# Altium project Shuttler_AMC.PrjPcb (part 5 of 20)

## Sheet DAC_supply.SchDoc: =ProjectName
size 420 x 297 mm; Author: T.P.; CompanyName: WUT; DrawnBy: T.P.; Organization: WUT ISE; Address1: Warsaw Univeristy of Technology; Address2: Nowowiejska 15/19; DocumentNumber: 26; Revision: 0.9; SheetNumber: 26; SheetTotal: 36; EDA_Number: ARTIQ; Projet: ARTIQ/SINARA; ModifiedBy: -; CreateDate: XX/XX/XXXX; CheckedDate: -; Title2: DAC_supply.SchDoc; DivGrp: ISE; Designer: G.K. and T.P.; ModifiedDate: -; ProjectName: ADC/DAC MEZZANINE
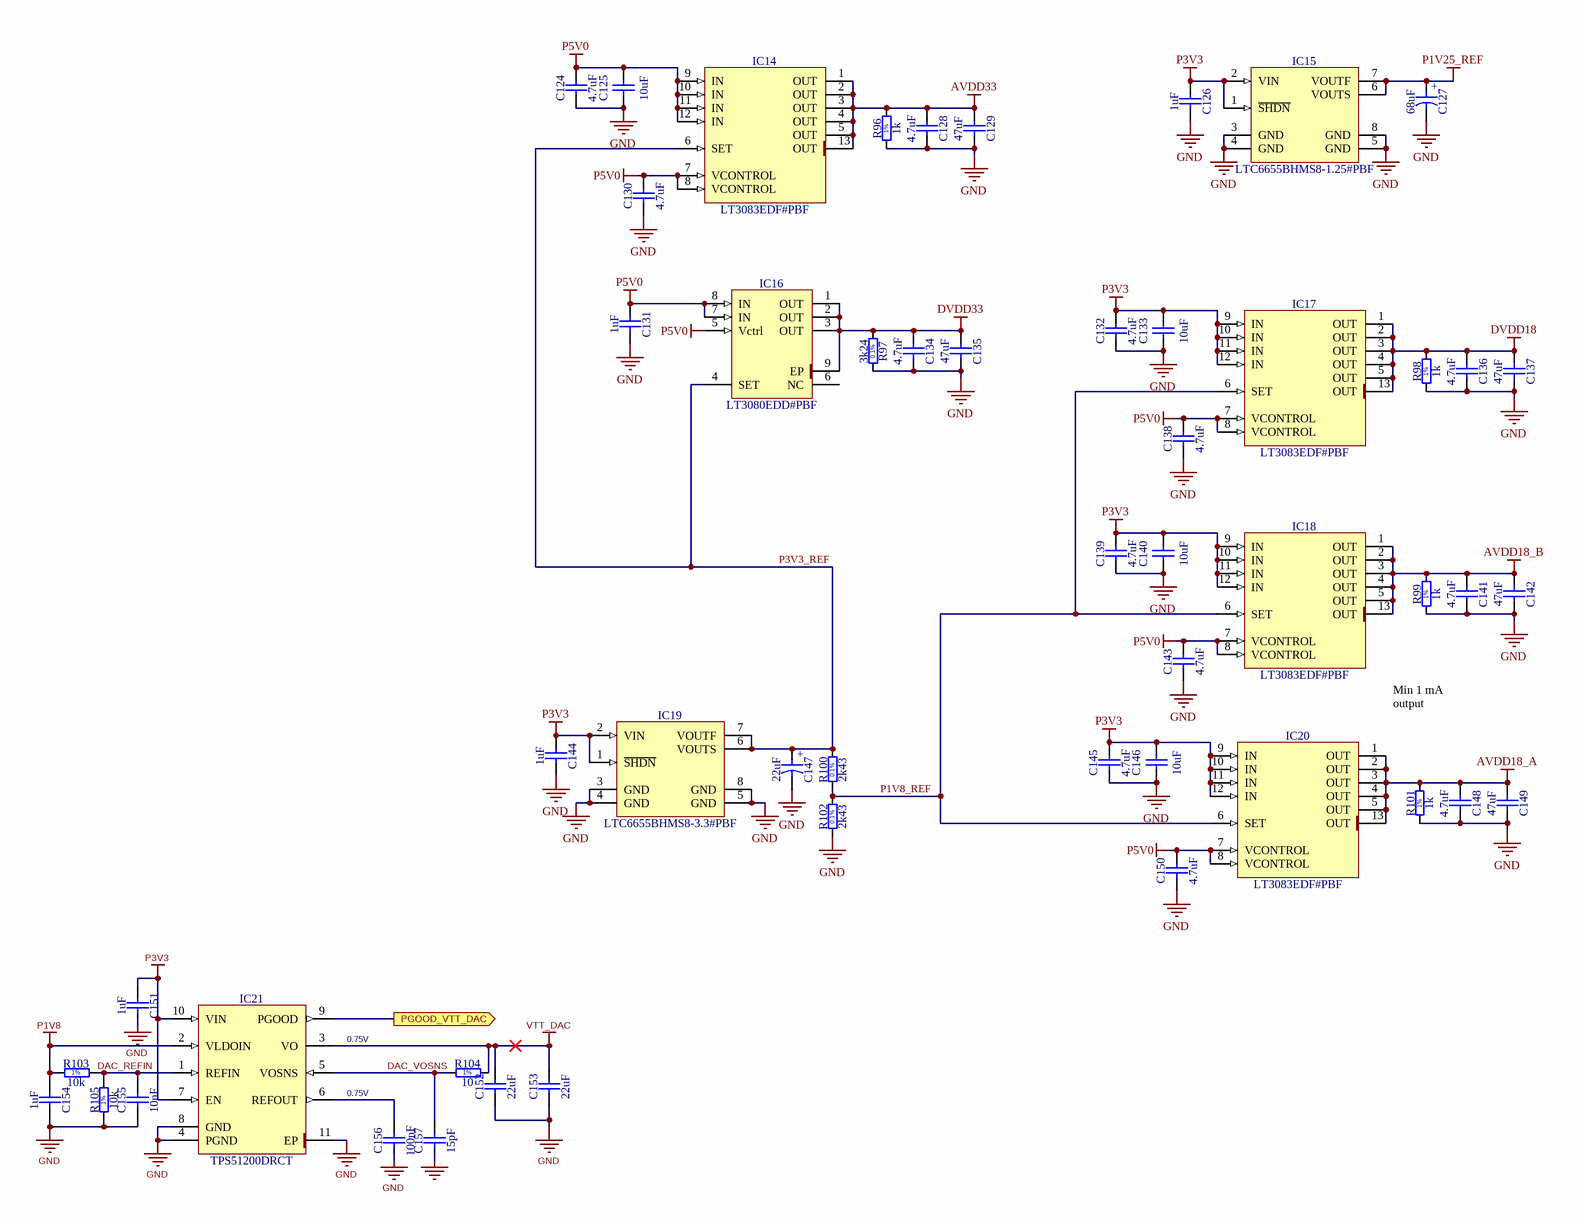
[diagram p8: DAC_supply.SchDoc]

### Parts
C124  4.7uF  [CAPC1005X55N]
C125  10uF  [CAPC3216X180N]
C126  1uF  [CAPC1005X55N]
C127  68uF  [CAPPR250-680X1080]
C128  4.7uF  [CAPC1005X55N]
C129  47uF  [CAPC3225X270N]
C130  4.7uF  [CAPC1005X55N]
C131  1uF  [CAPC1005X55N]
C132  4.7uF  [CAPC1005X55N]
C133  10uF  [CAPC3216X180N]
C134  4.7uF  [CAPC1005X55N]
C135  47uF  [CAPC3225X270N]
C136  4.7uF  [CAPC1005X55N]
C137  47uF  [CAPC3225X270N]
C138  4.7uF  [CAPC1005X55N]
C139  4.7uF  [CAPC1005X55N]
C140  10uF  [CAPC3216X180N]
C141  4.7uF  [CAPC1005X55N]
C142  47uF  [CAPC3225X270N]
C143  4.7uF  [CAPC1005X55N]
C144  1uF  [CAPC1005X55N]
C145  4.7uF  [CAPC1005X55N]
C146  10uF  [CAPC3216X180N]
C147  22uF  [CAPAE530X540N]
C148  4.7uF  [CAPC1005X55N]
C149  47uF  [CAPC3225X270N]
C150  4.7uF  [CAPC1005X55N]
C151  1uF  [CAPC1005X55N]
C152  22uF  [CAPC2012X135N]
C153  22uF  [CAPC2012X135N]
C154  1uF  [CAPC1005X55N]
C155  10nF  [CAPC1005X55N]
C156  100nF  [CAPC0603X33N]
C157  15pF  [CAPC1005X55N]
IC14  LT3083EDF#PBF  [SON50P400X400X80-13N-R275X350]
IC15  LTC6655BHMS8-1.25#PBF  [SOP65P490X110-8N]
IC16  LT3080EDD#PBF  [SON50P300X300X80-9N-R175X248]
IC17  LT3083EDF#PBF  [SON50P400X400X80-13N-R275X350]
IC18  LT3083EDF#PBF  [SON50P400X400X80-13N-R275X350]
IC19  LTC6655BHMS8-3.3#PBF  [SOP65P490X110-8N]
IC20  LT3083EDF#PBF  [SON50P400X400X80-13N-R275X350]
IC21  TPS51200DRCT  [TEXAS_DRC (S-PVSON-N10)]
R96  1k  [RESC1005X40N]
R97  3k24  [RESC1608X55N]
R98  1k  [RESC1005X40N]
R99  1k  [RESC1005X40N]
R100  2k43  [RESC1608X55N]
R101  1k  [RESC1005X40N]
R102  2k43  [RESC1608X55N]
R103  10k  [RESC1005X40N]
R104  10  [RESC1005X40N]
R105  10k  [RESC1005X40N]

### Ports
PGOOD_VTT_DAC (out)

### Nets
AVDD18_A: C148.2 C149.2 IC20.1(OUT) IC20.2(OUT) IC20.3(OUT) IC20.4(OUT) IC20.5(OUT) IC20.13(OUT) R101.2
AVDD18_B: C141.2 C142.2 IC18.1(OUT) IC18.2(OUT) IC18.3(OUT) IC18.4(OUT) IC18.5(OUT) IC18.13(OUT) R99.2
AVDD33: C128.2 C129.2 IC14.1(OUT) IC14.2(OUT) IC14.3(OUT) IC14.4(OUT) IC14.5(OUT) IC14.13(OUT) R96.2
DVDD18: C136.2 C137.2 IC17.1(OUT) IC17.2(OUT) IC17.3(OUT) IC17.4(OUT) IC17.5(OUT) IC17.13(OUT) R98.2
DVDD33: C134.2 C135.2 IC16.1(OUT) IC16.2(OUT) IC16.3(OUT) IC16.9(EP) R97.2
GND: C124.1 C125.1 C126.1 C127.2 C128.1 C129.1 C130.1 C131.1 C132.1 C133.1 C134.1 C135.1 C136.1 C137.1 C138.1 C139.1 C140.1 C141.1 C142.1 C143.1 C144.1 C145.1 C146.1 C147.2 C148.1 C149.1 C150.1 C151.2 C152.1 C153.1 C154.2 C155.1 C156.1 C157.1 IC15.3(GND) IC15.4(GND) IC15.5(GND) IC15.8(GND) IC19.3(GND) IC19.4(GND) IC19.5(GND) IC19.8(GND) IC21.4(PGND) IC21.8(GND) IC21.11(EP) R96.1 R97.1 R98.1 R99.1 R101.1 R102.1 R105.1
P1V8: C154.1 IC21.2(VLDOIN) R103.1
P1V25_REF: C127.1 IC15.6(VOUTS) IC15.7(VOUTF)
P3V3: C126.2 C132.2 C133.2 C139.2 C140.2 C144.2 C145.2 C146.2 C151.1 IC15.1(~{SHDN}) IC15.2(VIN) IC17.9(IN) IC17.10(IN) IC17.11(IN) IC17.12(IN) IC18.9(IN) IC18.10(IN) IC18.11(IN) IC18.12(IN) IC19.1(~{SHDN}) IC19.2(VIN) IC20.9(IN) IC20.10(IN) IC20.11(IN) IC20.12(IN) IC21.7(EN) IC21.10(VIN)
P5V0: C124.2 C125.2 C130.2 C131.2 C138.2 C143.2 C150.2 IC14.7(VCONTROL) IC14.8(VCONTROL) IC14.9(IN) IC14.10(IN) IC14.11(IN) IC14.12(IN) IC16.5(Vctrl) IC16.7(IN) IC16.8(IN) IC17.7(VCONTROL) IC17.8(VCONTROL) IC18.7(VCONTROL) IC18.8(VCONTROL) IC20.7(VCONTROL) IC20.8(VCONTROL)
VTT_DAC: C152.2 C153.2 IC21.3(VO) R104.2
DAC_REFIN: C155.2 IC21.1(REFIN) R103.2 R105.2
DAC_VOSNS: C157.2 IC21.5(VOSNS) R104.1
P1V8_REF: IC17.6(SET) IC18.6(SET) IC20.6(SET) R100.1 R102.2
P3V3_REF: C147.1 IC14.6(SET) IC16.4(SET) IC19.6(VOUTS) IC19.7(VOUTF) R100.2
PGOOD_VTT_DAC: IC21.9(PGOOD) ; port PGOOD_VTT_DAC
NetC156_2: C156.2 IC21.6(REFOUT)

Not connected (* = marked no-connect by the designer): IC16 6(NC)

### Notes on the sheet
- Min 1 mA output
- (near IC21) 0.75V
- 0.75V
- Project/Equipment
- Document
- Designer
- Drawn by
- Check.by
- File
- Last Mod.
- Print Date
- Sheet
- Size
- A3
- of
- Rev
- (in symbol CAE530-540_22UF_16V_20%) +
- (in symbol CAER_68UF_10V_20%_SANYO_10SA68M) +
- (in symbol R0402_1K_1%_0.0625W_100PPM) 1%
- (in symbol R0402_10K_1%_0.0625W_100PPM) 1%
- (in symbol R0402_10R_1%_0.0625W_200PPM) 1%
- (in symbol R0603_2K43_0.1%_0.063W_10PPM) 0.1%
- (in symbol R0603_3K24_0.1%_0.063W_10PPM) 0.1%

### Library data of the parts
C124 C128 C130 C132 C134 C136 C138 C139 C141 C143 C145 C148 C150 = CC0402_4.7UF_6.3V_20%_X5R: Non-polarised capacitor; Manufacturer: GENERIC; Part Description: SMD Multilayer Chip Ceramic Capacitor; Manufacturer1 Part Number: C1005X5R0J475M050BC; Tolerance: ±20%; Voltage: 6.3V; TC: X5R; Manufacturer Part Number: CC0402_4.7UF_6.3V_20%_X5R; Part Number: CC0402_4.7UF_6.3V_20%_X5R; Value: 4.7uF; Component Kind: Standard; Component Type: Standard; Pin Count: 2; Status: Preferred; Case: 0402; Mounted: Yes; Socket: No; SMD: Yes; Sense: No; Manufacturer1 Example: TDK; Manufacturer1 ComponentHeight: 0.65mm; HelpURL: \\cern.ch\dfs\Applications\Altium\Datasheets\CC0402_X5R_TDK_C.pdf; Author: CERN DEM JLC; CreateDate: 03.03.2015; LatestRevisionDate: 03.03.2015
C125 C133 C140 C146 = CC1206_10uF_25V_10%_X7R: Non-polarised capacitor; Manufacturer: GENERIC; Part Description: SMD Multilayer Chip Ceramic Capacitor; Manufacturer1 Part Number: C1206C106K4RACTU; Tolerance: ±10%; Voltage: 25V; TC: X7R; Manufacturer Part Number: CC1206_10uF_25V_10%_X7R; Part Number: CC1206_10UF_25V_10%_X7R; Value: 10uF; Component Kind: Standard; Component Type: Standard; Pin Count: 2; Status: Preferred; Case: 1206; Mounted: Yes; Socket: No; SMD: Yes; Sense: No; Manufacturer1 Example: KEMET; Manufacturer1 ComponentHeight: 1.8mm; HelpURL: \\cern.ch\dfs\Applications\Altium\Datasheets\CC1206_X7R_KEMET.pdf; Author: CERN DEM JLC; CreateDate: 12.09.2012; LatestRevisionDate: 12.09.2012
C126 C131 C144 C151 C154 = CC0402_1UF_16V_10%_X5R: Non-polarised capacitor; Manufacturer: GENERIC; Part Description: SMD Multilayer Chip Ceramic Capacitor; Manufacturer1 Part Number: C1005X5R1C105KT; Tolerance: ±10%; Voltage: 16V; TC: X5R; Manufacturer Part Number: CC0402_1UF_16V_10%_X5R; Part Number: CC0402_1UF_16V_10%_X5R; Value: 1uF; Component Kind: Standard; Component Type: Standard; Pin Count: 2; Status: Preferred; Case: 0402; Mounted: Yes; Socket: No; SMD: Yes; Sense: No; Manufacturer1 Example: TDK; Manufacturer1 ComponentHeight: 0.55mm; HelpURL: \\cern.ch\dfs\Applications\Altium\Datasheets\CC0402_X5R_TDK_C.pdf; Author: CERN DEM JLC; CreateDate: 25.10.2012; LatestRevisionDate: 25.10.2012
C127 = CAER_68UF_10V_20%_SANYO_10SA68M: Polarised capacitor; Part Description: Radial Lead Type , Aluminum Solid Capacitor with Organic Semiconductive Electrolyte, (SA Series); Manufacturer: SANYO OS-CON; Voltage: 10V; Tolerance: ±20%; Part Number: CAER_68UF_10V_20%_SANYO_10SA68M; Component Kind: Standard; Component Type: Standard; Pin Count: 2; Value: 68uF; Status: None; Manufacturer Part Number: 10SA68M; Case: LS2.5 D6.8 x H10.8; Mounted: Yes; Socket: No; SMD: No; Sense: No; ComponentHeight: 10.8mm; HelpURL: \\cern.ch\dfs\Applications\Altium\Datasheets\CAER_SANYO_SA.pdf; Author: CERN DEM JLC; CreateDate: 07.04.2009; LatestRevisionDate: 07.04.2009
C129 C135 C137 C142 C149 = CC1210_47UF_6.3V_10%_X5R: Non-polarised capacitor; Manufacturer: GENERIC; Part Description: SMD Multilayer Chip Ceramic Capacitor; Manufacturer1 Part Number: 12106D476KAT2A; Tolerance: ±10%; Voltage: 6.3V; TC: X5R; Manufacturer Part Number: CC1210_47UF_6.3V_10%_X5R; Part Number: CC1210_47UF_6.3V_10%_X5R; Value: 47uF; Component Kind: Standard; Component Type: Standard; Pin Count: 2; Status: Preferred; Case: 1210; Mounted: Yes; Socket: No; SMD: Yes; Sense: No; Manufacturer1 Example: AVX; Manufacturer1 ComponentHeight: 2.79mm; HelpURL: \\cern.ch\dfs\Applications\Altium\Datasheets\CC1210_X5R_AVX.pdf; Author: CERN DEM JLC; CreateDate: 12.11.2014; LatestRevisionDate: 12.11.2014
C147 = CAE530-540_22UF_16V_20%: Polarised capacitor; Part Description: Aluminum Electrolytic SMT Capacitor; Manufacturer: PANASONIC; Manufacturer Part Number: EEEFK1C220AR; Voltage: 16V; Tolerance: ±20%; Part Number: CAE530-540_22UF_16V_20%; Component Kind: Standard; Component Type: Standard; Pin Count: 2; Value: 22uF; Status: Not Recommended; Case: B; Mounted: Yes; Socket: No; SMD: Yes; Sense: No; ComponentHeight: 5.8mm; HelpURL: \\cern.ch\dfs\Applications\Altium\Datasheets\CAE_PANASONIC_FK.pdf; Author: CERN DEM JLC; CreateDate: 03.12.2007; LatestRevisionDate: 05.11.2014
C152 C153 = CC0805_22UF_10V_+80%-20%_Y5V: Non-polarised capacitor; Manufacturer: GENERIC; Part Description: SMD Multilayer Chip Ceramic Capacitor; Manufacturer1 Part Number: 2222 241 19881; Voltage: 10V; TC: Y5V; Manufacturer Part Number: CC0805_22UF_10V_+80%-20%_Y5V; Part Number: CC0805_22UF_10V_+80%-20%_Y5V; Tolerance: +80% -20%; Value: 22uF; Component Kind: Standard; Component Type: Standard; Pin Count: 2; Status: Preferred; Case: 0805; Mounted: Yes; Socket: No; SMD: Yes; Sense: No; Manufacturer1 Example: PHYCOMP; Manufacturer1 ComponentHeight: 1.45mm; HelpURL: \\cern.ch\dfs\Applications\Altium\Datasheets\CC0805_Y5V_PHYCOMP.pdf; Author: CERN DEM JLC; CreateDate: 03.12.2007; LatestRevisionDate: 03.12.2007
C155 = CC0402_10NF_25V_10%_X7R: Non-polarised capacitor; Manufacturer: GENERIC; Part Description: SMD Multilayer Chip Ceramic Capacitor; Manufacturer1 Part Number: C1005X7R1E103KT; Tolerance: ±10%; Voltage: 25V; TC: X7R; Manufacturer Part Number: CC0402_10NF_25V_10%_X7R; Part Number: CC0402_10NF_25V_10%_X7R; Value: 10nF; Component Kind: Standard; Component Type: Standard; Pin Count: 2; Status: Preferred; Case: 0402; Mounted: Yes; Socket: No; SMD: Yes; Sense: No; Manufacturer1 Example: TDK; Manufacturer1 ComponentHeight: 0.55mm; HelpURL: \\cern.ch\dfs\Applications\Altium\Datasheets\CC0402_X7R_TDK_C.pdf; Author: CERN DEM JLC; CreateDate: 25.10.2012; LatestRevisionDate: 25.10.2012
C156 = CC0201_100NF_6.3V_10%_X5R: Non-polarised capacitor; Manufacturer: GENERIC; Manufacturer1 Part Number: 02016D104KAT2A; Part Description: SMD Multilayer Chip Ceramic Capacitor; TC: X5R; Tolerance: ±10%; Voltage: 6.3V; Author: CERN DEM JLC; Case: 0201; Component Kind: Standard; Component Type: Standard; CreateDate: 03.12.2007; HelpURL: \\cern.ch\dfs\Applications\Altium\Datasheets\CC0201_X5R_AVX.pdf; LatestRevisionDate: 03.12.2007; Manufacturer Part Number: CC0201_100NF_6.3V_10%_X5R; Manufacturer1 ComponentHeight: 0.33mm; Manufacturer1 Example: AVX; Mounted: Yes; Part Number: CC0201_100NF_6.3V_10%_X5R; Pin Count: 2; SMD: Yes; Socket: No; Status: Not Recommended; Value: 100nF; Sense: No
C157 = CC0402_15PF_50V_5%_C0G: Non-polarised capacitor; Manufacturer: GENERIC; Part Description: SMD Multilayer Chip Ceramic Capacitor; Manufacturer1 Part Number: C0402C150J5GACTU; Tolerance: ±5%; Voltage: 50V; TC: C0G/NP0; Manufacturer Part Number: CC0402_15PF_50V_5%_C0G; Part Number: CC0402_15PF_50V_5%_C0G; Value: 15pF; Component Kind: Standard; Component Type: Standard; Pin Count: 2; Status: Preferred; Case: 0402; Mounted: Yes; Socket: No; SMD: Yes; Sense: No; Manufacturer1 Example: KEMET; Manufacturer1 ComponentHeight: 0.55mm; HelpURL: \\cern.ch\dfs\Applications\Altium\Datasheets\CC0805_C0G_KEMET_(Commercial Grade).pdf; Author: CERN DEM JLC; CreateDate: 03.12.2007; LatestRevisionDate: 22.04.2015
IC14 IC17 IC18 IC20 = LT3083EDF#PBF: Adjustable, 3A, Single Resistor Low Dropout Regulator; Manufacturer: LINEAR TECHNOLOGY; PressFit: No; Bonding: No; Part Number: LT3083EDF#PBF; Component Kind: Standard; Component Type: Standard; Device: LT3083EDF#PBF; PackageDescription: SON, 0.50mm Pitch; 14 Pin 4.00mm W X 4.00mm L X 0.80mm H body (w/thermal tab 2.75 X 3.5 mm), IPC Medium Density; Part Description: Adjustable, 3A, Single Resistor Low Dropout Regulator; Manufacturer Part Number: LT3083EDF#PBF; Pin Count: 13; Case: SON12; Mounted: Yes; Socket: No; SMD: Yes; Sense: No; ComponentHeight: 0.8mm; HelpURL: \\cern.ch\dfs\Applications\Altium\Datasheets\LT3083EDF#PBF.pdf; Author: CERN DEM MR; CreateDate: 29.11.2017; LatestRevisionDate: 29.11.2017
IC15 = LTC6655BHMS8-1.25#PBF: 0.25ppm Noise, Low Drift Precision Buffered Voltage Reference; Part Description: 1.25V, 0.25ppm Noise, Low Drift Precision Buffered Voltage Reference; Manufacturer: LINEAR TECHNOLOGY; PressFit: No; Bonding: No; Part Number: LTC6655BHMS8-1.25#PBF; Component Kind: Standard; Component Type: Standard; Device: LTC6655BHMS8-1.25#PBF; PackageDescription: SOP, 8-Leads, Body 3.1x3.1mm (max), Pitch 0.65mm, IPC Medium Density; Manufacturer Part Number: LTC6655BHMS8-1.25#PBF; Pin Count: 8; Case: SSOP8; Mounted: Yes; Socket: No; SMD: Yes; Sense: No; ComponentHeight: 1.1mm; HelpURL: \\cern.ch\dfs\Applications\Altium\Datasheets\LTC6655BHMS8-1.25#PBF.pdf; Author: CERN DEM JLC; CreateDate: 22.11.2016; LatestRevisionDate: 22.11.2016
IC16 = LT3080EDD#PBF: Adjustable 1.1A Single Resistor Low Dropout Regulator; Part Description: 0 To 36V Adjustable 1.1A Single Resistor Low Dropout Regulator; Manufacturer: LINEAR TECHNOLOGY; PressFit: No; Bonding: No; Part Number: LT3080EDD#PBF; Component Kind: Standard; Component Type: Standard; Device: LT3080EDD#PBF; PackageDescription: SON, (DFN) 0.50mm,pitch; 8 pin,3.00mm W X 3.00mm L X 0.80mm H body (w/thermal tab 1.75 X2.48mm), IPC Medium Density; Manufacturer Part Number: LT3080EDD#PBF; Pin Count: 9; Case: SON8; Mounted: Yes; Socket: No; SMD: Yes; Sense: No; ComponentHeight: 0.8mm; HelpURL: \\cern.ch\dfs\Applications\Altium\Datasheets\LT3080EDD#PBF.pdf; Author: CERN DEM JLC; CreateDate: 18.01.2010; LatestRevisionDate: 18.01.2010
IC19 = LTC6655BHMS8-3.3#PBF: 0.25ppm Noise, Low Drift Precision Buffered Voltage Reference; Part Description: 3V3, 0.25ppm Noise, Low Drift Precision Buffered Voltage Reference; Manufacturer: LINEAR TECHNOLOGY; PressFit: No; Bonding: No; Part Number: LTC6655BHMS8-3.3#PBF; Component Kind: Standard; Component Type: Standard; Device: LTC6655BHMS8-3.3#PBF; PackageDescription: SOP, 8-Leads, Body 3.1x3.1mm (max), Pitch 0.65mm, IPC Medium Density; Manufacturer Part Number: LTC6655BHMS8-3.3#PBF; Pin Count: 8; Case: SSOP8; Mounted: Yes; Socket: No; SMD: Yes; Sense: No; ComponentHeight: 1.1mm; HelpURL: \\cern.ch\dfs\Applications\Altium\Datasheets\LTC6655BHMS8-3.3#PBF.pdf; Author: CERN DEM BC; CreateDate: 03.03.2016; LatestRevisionDate: 22.11.2016
IC21 = TPS51200DRCT: Sink/Source DDR Termination Regulator; Manufacturer: TEXAS INSTRUMENTS; Part Description: 3.3V Sink/Source DDR Termination Regulator; PressFit: No; Bonding: No; Manufacturer Part Number: TPS51200DRCT; PackageDescription: SON, 0.50mm Pitch, 10-pin, 3.00mm W  X 3.00mm L X 1.00mm Height, (w/thermal tab 1.75 X 2.50 mm); Part Number: TPS51200DRCT; Component Kind: Standard; Component Type: Standard; Device: TPS51200DRCT; Pin Count: 11; Case: SON10; Mounted: Yes; Socket: No; SMD: Yes; Sense: No; ComponentHeight: 1mm; HelpURL: \\cern.ch\dfs\Applications\Altium\Datasheets\TPS51200DRCT.pdf; Author: CERN DEM JLC; CreateDate: 03.02.2010; LatestRevisionDate: 06.11.2013
R96 R98 R99 R101 = R0402_1K_1%_0.0625W_100PPM: Resistor - 1%; Part Description: General Purpose Thick Film Chip Resistor; Manufacturer: GENERIC; Manufacturer1 Part Number: 232270671002L; TC: ±100ppm/°C; PressFit: No; Part Number: R0402_1K_1%_0.0625W_100PPM; Component Kind: Standard; Component Type: Standard; Pin Count: 2; Value: 1k; Status: Not Recommended; Power: 0.0625W; Tolerance: ±1%; Manufacturer Part Number: R0402_1K_1%_0.0625W_100PPM; Case: 0402; Mounted: Yes; Sense: No; Socket: No; SMD: Yes; Manufacturer1 Example: YAGEO PHYCOMP; Manufacturer1 ComponentHeight: 0.4mm; HelpURL: \\cern.ch\dfs\Applications\Altium\Datasheets\R0402_Phycomp_RC0402.pdf; Author: CERN DEM JLC; CreateDate: 03.12.2007; LatestRevisionDate: 17.10.2012
R97 = R0603_3K24_0.1%_0.063W_10PPM: Resistor - 0.1%; Part Description: Thin Film Chip Resistor; Manufacturer: GENERIC; Manufacturer1 Part Number: RN73C1J3K24BTDF; Power: 0.063W; TC: ±10ppm; PressFit: No; Part Number: R0603_3K24_0.1%_0.063W_10PPM; Component Kind: Standard; Component Type: Standard; Pin Count: 2; Value: 3k24; Status: Not Recommended; Tolerance: ±0.1%; Manufacturer Part Number: R0603_3K24_0.1%_0.063W_10PPM; Case: 0603; Mounted: Yes; Sense: No; Socket: No; SMD: Yes; Manufacturer1 Example: TYCO HOLSWORTHY; Manufacturer1 ComponentHeight: 0.5mm; HelpURL: \\cern.ch\dfs\Applications\Altium\Datasheets\R0603_Tyco_RN73.pdf; Author: CERN DEM JLC; CreateDate: 03.12.2007; LatestRevisionDate: 13.03.2008
R100 R102 = R0603_2K43_0.1%_0.063W_10PPM: Resistor - 0.1%; Part Description: Thin Film Chip Resistor; Manufacturer: GENERIC; Manufacturer1 Part Number: RN73C1J2K43BTDF; Power: 0.063W; TC: ±10ppm; PressFit: No; Part Number: R0603_2K43_0.1%_0.063W_10PPM; Component Kind: Standard; Component Type: Standard; Pin Count: 2; Value: 2k43; Status: Not Recommended; Tolerance: ±0.1%; Manufacturer Part Number: R0603_2K43_0.1%_0.063W_10PPM; Case: 0603; Mounted: Yes; Sense: No; Socket: No; SMD: Yes; Manufacturer1 Example: TYCO HOLSWORTHY; Manufacturer1 ComponentHeight: 0.5mm; HelpURL: \\cern.ch\dfs\Applications\Altium\Datasheets\R0603_Tyco_RN73.pdf; Author: CERN DEM JLC; CreateDate: 03.12.2007; LatestRevisionDate: 13.03.2008
R103 R105 = R0402_10K_1%_0.0625W_100PPM: Resistor - 1%; Manufacturer: GENERIC; Part Description: General Purpose Thick Film Chip Resistor; Manufacturer1 Part Number: 232270671003L; TC: ±100ppm/°C; PressFit: No; Manufacturer Part Number: R0402_10K_1%_0.0625W_100PPM; Part Number: R0402_10K_1%_0.0625W_100PPM; Tolerance: ±1%; Value: 10k; Component Kind: Standard; Component Type: Standard; Pin Count: 2; Status: Not Recommended; Power: 0.0625W; Case: 0402; Mounted: Yes; Sense: No; Socket: No; SMD: Yes; Manufacturer1 Example: YAGEO PHYCOMP; Manufacturer1 ComponentHeight: 0.4mm; HelpURL: \\cern.ch\dfs\Applications\Altium\Datasheets\R0402_Phycomp_RC0402.pdf; Author: CERN DEM JLC; CreateDate: 03.12.2007; LatestRevisionDate: 17.10.2012
R104 = R0402_10R_1%_0.0625W_200PPM: Resistor - 1%; Manufacturer: GENERIC; Part Description: General Purpose Thick Film Chip Resistor; Manufacturer1 Part Number: 232270671009L; TC: ±200ppm/°C; PressFit: No; Manufacturer Part Number: R0402_10R_1%_0.0625W_200PPM; Part Number: R0402_10R_1%_0.0625W_200PPM; Tolerance: ±1%; Value: 10; Component Kind: Standard; Component Type: Standard; Pin Count: 2; Status: Not Recommended; Power: 0.0625W; Case: 0402; Mounted: Yes; Sense: No; Socket: No; SMD: Yes; Manufacturer1 Example: YAGEO PHYCOMP; Manufacturer1 ComponentHeight: 0.4mm; HelpURL: \\cern.ch\dfs\Applications\Altium\Datasheets\R0402_Phycomp_RC0402.pdf; Author: CERN DEM JLC; CreateDate: 24.06.2009; LatestRevisionDate: 17.10.2012

## Sheet PWR_Buck_4V_20A.SchDoc: =ProjectName
size 420 x 297 mm; Author: T.P; CompanyName: WUT; DrawnBy: T.P.; Organization: WUT ISE; Address1: Warsaw Univeristy of Technology; Address2: Nowowiejska 15/19; DocumentNumber: 30; Revision: 0.9; SheetNumber: 30; SheetTotal: 36; EDA_Number: ARTIQ; Projet: ARTIQ/SINARA; ModifiedBy: -; CreateDate: XX/XX/XXXX; CheckedDate: -; Title2: PWR_Buck_4V_20A.SchDoc; DivGrp: ISE; Designer: G.K. and T.P.
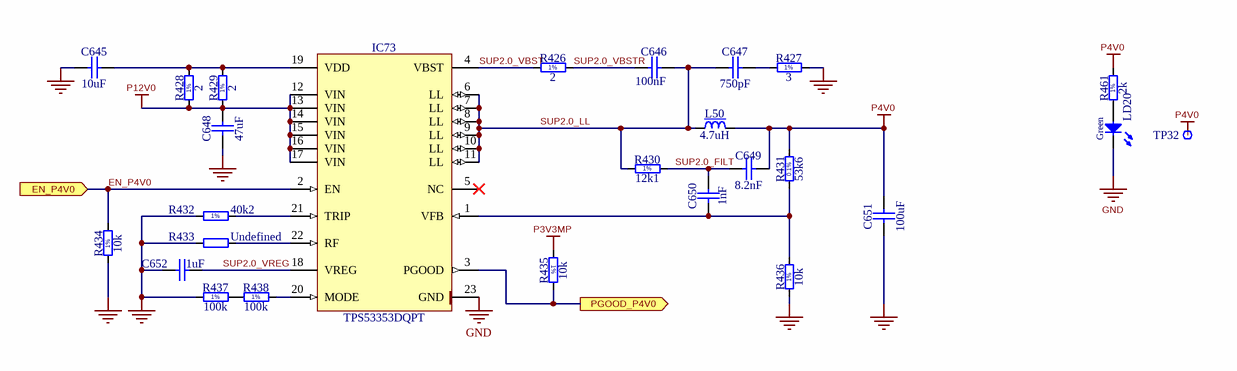
[diagram p9: PWR_Buck_4V_20A.SchDoc]

### Parts
C645  10uF  [CAPC3216X180N]
C646  100nF  [CAPC1005X55N]
C647  750pF  [CAPC1608X87N]
C648  47uF  [CAPC3225X270N]
C649  8.2nF  [CAPC1608X87N]
C650  1nF  [CAPC1005X55N]
C651  100uF  [CAPC3216X180N]
C652  1uF  [CAPC1608X87N]
IC73  TPS53353DQPT  [SON50P500X600X150-23N-R334X557]
L50  4.7uH  [IND_TDK_SPM6530]
LD20  Green  [LED_OSRAM_LGL29K]
R426  2  [RESC1608X55N]
R427  3  [RESC3216X65N]
R428  2  [RESC1608X55N]
R429  2  [RESC1608X55N]
R430  12k1  [RESC1005X40N]
R431  53k6  [RESC1608X55N]
R432  40k2  [RESC2012X60N]
R433  Undefined  [RESC1005X40N]
R434  10k  [RESC1005X40N]
R435  10k  [RESC1005X40N]
R436  10k  [RESC1005X40N]
R437  100k  [RESC1005X40N]
R438  100k  [RESC1005X40N]
R461  2k  [RESC1005X40N]
TP32  Test Point  [TPS127]  (value not drawn)

### Ports
EN_P4V0 (in), PGOOD_P4V0 (out)

### Nets
GND: C645.2 C648.1 C651.1 C652.2 IC73.23(GND) LD20.1(C) R427.2 R432.2 R433.2 R434.2 R436.1 R437.1
P3V3MP: R435.2
P4V0: C649.2 C651.2 L50.2 R431.2 R461.2 TP32.1
P12V0: C648.2 IC73.12(VIN) IC73.13(VIN) IC73.14(VIN) IC73.15(VIN) IC73.16(VIN) IC73.17(VIN) R428.1 R429.1
EN_P4V0: IC73.2(EN) R434.1 ; port EN_P4V0
PGOOD_P4V0: IC73.3(PGOOD) R435.1 ; port PGOOD_P4V0
SUP2.0_FILT: C649.1 C650.2 R430.2
SUP2.0_LL: C646.2 C647.1 IC73.6(LL) IC73.7(LL) IC73.8(LL) IC73.9(LL) IC73.10(LL) IC73.11(LL) L50.1 R430.1
SUP2.0_VBST: IC73.4(VBST) R426.1
SUP2.0_VBSTR: C646.1 R426.2
SUP2.0_VREG: C652.1 IC73.18(VREG)
NetC645_1: C645.1 IC73.19(VDD) R428.2 R429.2
NetC647_2: C647.2 R427.1
NetC650_1: C650.1 IC73.1(VFB) R431.1 R436.2
NetIC73_20: IC73.20(MODE) R438.2
NetIC73_21: IC73.21(TRIP) R432.1
NetIC73_22: IC73.22(RF) R433.1
NetLD20_2: LD20.2(A) R461.1
NetR437_2: R437.2 R438.1

Not connected (* = marked no-connect by the designer): IC73 5(NC)*

### Notes on the sheet
- Project/Equipment
- Document
- Designer
- Drawn by
- Check.by
- File
- Last Mod.
- Print Date
- Sheet
- Size
- A3
- of
- Rev
- (in symbol R0402_2K_1%_0.0625W_100PPM) 1%
- (in symbol R0402_10K_1%_0.0625W_100PPM) 1%
- (in symbol R0402_12K1_1%_0.0625W_100PPM) 1%
- (in symbol R0402_100K_1%_0.0625W_100PPM) 1%
- (in symbol R0603_2R_1%_0.1W_200PPM) 1%
- (in symbol R0603_53K6_0.1%_0.063W_10PPM) 0.1%
- (in symbol R0805_40K2_1%_0.125W_100PPM) 1%
- (in symbol R1206_3R_1%_0.25W_200PPM) 1%

### Library data of the parts
C645 = CC1206_10uF_25V_10%_X7R: as C125 on sheet DAC_supply; Manufacturer Part Number: CC1206_10uF_25V_10%_X7R; Part Number: CC1206_10UF_25V_10%_X7R; Value: 10uF; Component Kind: Standard; Component Type: Standard; Pin Count: 2; Status: Preferred; Case: 1206; Mounted: Yes; Socket: No; SMD: Yes; Sense: No; Manufacturer1 Example: KEMET; Manufacturer1 ComponentHeight: 1.8mm; HelpURL: \\cern.ch\dfs\Applications\Altium\Datasheets\CC1206_X7R_KEMET.pdf; Author: CERN DEM JLC; CreateDate: 12.09.2012; LatestRevisionDate: 12.09.2012
C646 = CC0402_100NF_16V_10%_X5R: Non-polarised capacitor; Manufacturer: GENERIC; Part Description: SMD Multilayer Chip Ceramic Capacitor; Manufacturer1 Part Number: GRM155R61C104KA88D; Tolerance: ±10%; Voltage: 16V; TC: X5R; Manufacturer Part Number: CC0402_100NF_16V_10%_X5R; Part Number: CC0402_100NF_16V_10%_X5R; Value: 100nF; Component Kind: Standard; Component Type: Standard; Pin Count: 2; Status: None; Case: 0402; Mounted: Yes; Socket: No; SMD: Yes; Sense: No; Manufacturer1 Example: MURATA; Manufacturer1 ComponentHeight: 0.55mm; HelpURL: \\cern.ch\dfs\Applications\Altium\Datasheets\CC0402_X5R_MURATA_GRM.pdf; Author: CERN DEM JLC; CreateDate: 10.12.2013; LatestRevisionDate: 10.12.2013
C647 = CC0603_750PF_50V_5%_C0G: Non-polarised capacitor; Part Description: SMD Multilayer Chip Ceramic Capacitor; Manufacturer: GENERIC; Manufacturer1 Part Number: C0603C751J5GACTU; Voltage: 50V; TC: C0G/NP0; Tolerance: ±5%; Part Number: CC0603_750PF_50V_5%_C0G; Component Kind: Standard; Component Type: Standard; Pin Count: 2; Value: 750pF; Status: Preferred; Manufacturer Part Number: CC0603_750PF_50V_5%_C0G; Case: 0603; Mounted: Yes; Socket: No; SMD: Yes; Sense: No; Manufacturer1 Example: KEMET; Manufacturer1 ComponentHeight: 0.87mm; HelpURL: \\cern.ch\dfs\Applications\Altium\Datasheets\CC0805_C0G_KEMET_(Commercial Grade).pdf; Author: CERN DEM JLC; CreateDate: 22.03.2011; LatestRevisionDate: 22.04.2015
C648 = CC1210_47UF_16V_20%_X5R: Non-polarised capacitor; Part Description: SMD Multilayer Chip Ceramic Capacitor; Manufacturer: GENERIC; Manufacturer1 Part Number: EMK325BJ476MM-T; Voltage: 16V; TC: X5R; Tolerance: ±20%; Part Number: CC1210_47UF_16V_20%_X5R; Component Kind: Standard; Component Type: Standard; Pin Count: 2; Value: 47uF; Status: None; Manufacturer Part Number: CC1210_47UF_16V_20%_X5R; Case: 1210; Mounted: Yes; Socket: No; SMD: Yes; Sense: No; Manufacturer1 Example: TAIYO YUDEN; Manufacturer1 ComponentHeight: 2.7mm; HelpURL: \\cern.ch\dfs\Applications\Altium\Datasheets\CC1210_X5R_TAIYO-YUDEN_HIGH-VALUE.pdf; Author: CERN DEM MR; CreateDate: 03.02.2016; LatestRevisionDate: 03.02.2016
C649 = CC0603_8.2NF_50V_5%_X7R: Non-polarised capacitor; Part Description: SMD Multilayer Chip Ceramic Capacitor; Manufacturer: GENERIC; Manufacturer1 Part Number: 223858615635; Voltage: 50V; TC: X7R; Tolerance: ±5%; Part Number: CC0603_8.2NF_50V_5%_X7R; Component Kind: Standard; Component Type: Standard; Pin Count: 2; Value: 8.2nF; Status: Preferred; Manufacturer Part Number: CC0603_8.2NF_50V_5%_X7R; Case: 0603; Mounted: Yes; Socket: No; SMD: Yes; Sense: No; Manufacturer1 Example: PHYCOMP; Manufacturer1 ComponentHeight: 0.87mm; HelpURL: \\cern.ch\dfs\Applications\Altium\Datasheets\CC0603_X7R_PHYCOMP.pdf; Author: CERN DEM JLC; CreateDate: 03.12.2007; LatestRevisionDate: 03.12.2007
C650 = CC0402_1NF_50V_10%_X7R: Non-polarised capacitor; Manufacturer: GENERIC; Part Description: SMD Multilayer Chip Ceramic Capacitor; Manufacturer1 Part Number: 223858715623; Tolerance: ±10%; Voltage: 50V; TC: X7R; Manufacturer Part Number: CC0402_1NF_50V_10%_X7R; Part Number: CC0402_1NF_50V_10%_X7R; Value: 1nF; Component Kind: Standard; Component Type: Standard; Pin Count: 2; Status: Not Recommended; Case: 0402; Mounted: Yes; Socket: No; SMD: Yes; Sense: No; Manufacturer1 Example: PHYCOMP; Manufacturer1 ComponentHeight: 0.55mm; HelpURL: \\cern.ch\dfs\Applications\Altium\Datasheets\CC0402_X7R_PHYCOMP.pdf; Author: CERN DEM JLC; CreateDate: 03.12.2007; LatestRevisionDate: 03.12.2007
C651 = CC1206_100UF_6.3V_20%_X5R: Non-polarised capacitor; Manufacturer: GENERIC; Part Description: SMD Multilayer Chip Ceramic Capacitor; Manufacturer1 Part Number: C1206C107M9PACTU; Tolerance: ±10%; Voltage: 6.3V; TC: X5R; Manufacturer Part Number: CC1206_100UF_6.3V_20%_X5R; Part Number: CC1206_100UF_6.3V_20%_X5R; Value: 100uF; Component Kind: Standard; Component Type: Standard; Pin Count: 2; Status: None; Case: 1206; Mounted: Yes; Socket: No; SMD: Yes; Sense: No; Manufacturer1 Example: KEMET; Manufacturer1 ComponentHeight: 1.8mm; HelpURL: \\cern.ch\dfs\Applications\Altium\Datasheets\CC1206_X5R_KEMET.pdf; Author: CERN DEM JLC; CreateDate: 26.09.2012; LatestRevisionDate: 26.09.2012
C652 = CC0603_1UF_25V_10%_X7R: Non-polarised capacitor; Manufacturer: GENERIC; Part Description: SMD Multilayer Chip Ceramic Capacitor; Manufacturer1 Part Number: GRM188R71E105KA12D; Tolerance: ±10%; Voltage: 25V; TC: X7R; Manufacturer Part Number: CC0603_1UF_25V_10%_X7R; Part Number: CC0603_1UF_25V_10%_X7R; Value: 1uF; Component Kind: Standard; Component Type: Standard; Pin Count: 2; Status: None; Case: 0603; Mounted: Yes; Socket: No; SMD: Yes; Sense: No; Manufacturer1 Example: MURATA; Manufacturer1 ComponentHeight: 0.9mm; HelpURL: \\cern.ch\dfs\Applications\Altium\Datasheets\CC0603_X7R_MURATA.pdf; Author: CERN DEM JLC; CreateDate: 18.01.2011; LatestRevisionDate: 18.01.2011
IC73 = TPS53353DQPT: 1.5V to 15V Input (4.5V to 25V Bias), 20A Synchronous Buck SWIFT™ Converter with Eco-mode™; Manufacturer: TEXAS INSTRUMENTS; Autho: TP; PressFit: No; Bonding: No; Mounted: Yes; Part Number: TPS53353DQPT; Pin Count: 23; Socket: No; Sense: No; SMD: Yes; Case: SON22; Component Kind: Standard; Component Type: Standard; ComponentHeight: 1.5mm; CreateDate: 17.01.2019; Device: TPS53353DQPT; Manufacturer Part Number: TPS53353DQPT; PackageDescription: SON, 0.50mm Pitch; 22 Pin, 5.00mm W X 6.00mm L X 1.50mm H Body (w/Thermal Tab 3.34 X 5.57mm), IPC Medium Density; Part Description: 1.5V to 15V Input (4.5V to 25V Bias), 20A Synchronous Buck SWIFT™ Converter with Eco-mode™
L50 = SPM6530T-4R7M: Inductor With Core; Part Description: SMD Inductor for Power Circuits (Wound Metal), SPM Series; Part Number: IND_4.7UH_20%_TDK_SPM6530; Manufacturer: TDK; Autho: TP; Power: 5.6A; Resistance: 0.039R; Tolerance: ±20%; Pin Count: 2; Sense: No; Socket: No; SMD: Yes; Component Kind: Standard; Component Type: Standard; ComponentHeight: 3mm; CreateDate: 16.01.2019; Manufacturer Part Number: SPM6530T-4R7M; Mounted: Yes; Status: None; Value: 4.7uH
LD20 = LED_OSRAM_LG L29K-G2J1-24-Z: LED Green 1C 2A; Manufacturer: OSRAM; Part Description: Surface Mount Green LED (0603 Case); Bonding: No; PressFit: No; Status Comment: Sourcing Difficulty; Author: CERN DEM JLC; Case: 0603; Color: Green; Component Kind: Standard; Component Type: Standard; ComponentHeight: 0.67mm; CreateDate: 24.04.2012; HelpURL: \\cern.ch\dfs\Applications\Altium\Datasheets\LED_OSRAM_LGL29K.pdf; LatestRevisionDate: 24.04.2012; Manufacturer Part Number: LG L29K-G2J1-24-Z; Mounted: Yes; PackageDescription: Green Chip LED, 2-Leads, Body 1.7x0.8mm, IPC Medium Density; Part Number: LED_OSRAM_LG L29K-G2J1-24-Z; Pin Count: 2; SMD: Yes; Socket: No; Status: Not Recommended; Sense: No
R426 R428 R429 = R0603_2R_1%_0.1W_200PPM: Resistor - 1%; Manufacturer: GENERIC; Part Description: General Purpose Thick Film Chip Resistor; Manufacturer1 Part Number: 232270462008L or RC0603FR-072RL; Power: 0.1W; TC: ±200ppm/°C; PressFit: No; Manufacturer Part Number: R0603_2R_1%_0.1W_200PPM; Part Number: R0603_2R_1%_0.1W_200PPM; Tolerance: ±1%; Value: 2; Component Kind: Standard; Component Type: Standard; Pin Count: 2; Status: Preferred; Case: 0603; Mounted: Yes; Sense: No; Socket: No; SMD: Yes; Manufacturer1 Example: YAGEO PHYCOMP; Manufacturer1 ComponentHeight: 0.65mm; HelpURL: \\cern.ch\dfs\Applications\Altium\Datasheets\R0603_Tyco_RN73.pdf; Author: CERN DEM JLC; CreateDate: 03.12.2007; LatestRevisionDate: 17.10.2012
R427 = R1206_3R_1%_0.25W_200PPM: Resistor - 1%; Manufacturer: GENERIC; Part Description: General Purpose Thick Film Chip Resistor; Manufacturer1 Part Number: 232272463008; Power: 0.25W; TC: ±200ppm/°C; PressFit: No; Manufacturer Part Number: R1206_3R_1%_0.25W_200PPM; Part Number: R1206_3R_1%_0.25W_200PPM; Tolerance: ±1%; Value: 3; Component Kind: Standard; Component Type: Standard; Pin Count: 2; Status: Preferred; Case: 1206; Mounted: Yes; Sense: No; Socket: No; SMD: Yes; Manufacturer1 Example: PHYCOMP; Manufacturer1 ComponentHeight: 0.65mm; HelpURL: \\cern.ch\dfs\Applications\Altium\Datasheets\R1206_Phycomp_RC1206.pdf; Author: CERN DEM JLC; CreateDate: 03.12.2007; LatestRevisionDate: 24.06.2009
R430 = R0402_12K1_1%_0.0625W_100PPM: Resistor - 1%; Part Description: General Purpose Thick Film Chip Resistor; Manufacturer: GENERIC; Manufacturer1 Part Number: 232270671213L or RC0402FR-0712K1L; TC: ±100ppm/°C; PressFit: No; Part Number: R0402_12K1_1%_0.0625W_100PPM; Component Kind: Standard; Component Type: Standard; Pin Count: 2; Value: 12k1; Status: Not Recommended; Power: 0.0625W; Tolerance: ±1%; Manufacturer Part Number: R0402_12K1_1%_0.0625W_100PPM; Case: 0402; Mounted: Yes; Sense: No; Socket: No; SMD: Yes; Manufacturer1 Example: YAGEO PHYCOMP; Manufacturer1 ComponentHeight: 0.4mm; HelpURL: \\cern.ch\dfs\Applications\Altium\Datasheets\R0402_Phycomp_RC0402.pdf; Author: CERN DEM JLC; CreateDate: 24.10.2012; LatestRevisionDate: 24.10.2012
R431 = R0603_53K6_0.1%_0.063W_10PPM: Resistor - 0.1%; Part Description: Thin Film Chip Resistor; Manufacturer: GENERIC; Manufacturer1 Part Number: RN73C1J53K6BTDF; Power: 0.063W; TC: ±10ppm; PressFit: No; Part Number: R0603_53K6_0.1%_0.063W_10PPM; Component Kind: Standard; Component Type: Standard; Pin Count: 2; Value: 53k6; Status: Not Recommended; Tolerance: ±0.1%; Manufacturer Part Number: R0603_53K6_0.1%_0.063W_10PPM; Case: 0603; Mounted: Yes; Sense: No; Socket: No; SMD: Yes; Manufacturer1 Example: TYCO HOLSWORTHY; Manufacturer1 ComponentHeight: 0.5mm; HelpURL: \\cern.ch\dfs\Applications\Altium\Datasheets\R0603_Tyco_RN73.pdf; Author: CERN DEM JLC; CreateDate: 03.12.2007; LatestRevisionDate: 13.03.2008
R432 = R0805_40K2_1%_0.125W_100PPM: Resistor - 1%; Part Description: Thick Film Chip Resistor; Manufacturer: VISHAY; Manufacturer1 Part Number: CRCW080540K2FKEA; Power: 0.125W; TC: ±100ppm/°C; PressFit: No; Part Number: R0805_40K2_1%_0.125W_100PPM; Component Kind: Standard; Component Type: Standard; Pin Count: 2; Value: 40k2; Status: None; Tolerance: ±1%; Manufacturer Part Number: R0805_40K2_1%_0.125W_100PPM; Case: 0805; Mounted: Yes; Sense: No; Socket: No; SMD: Yes; Manufacturer1 Example: VISHAY; Manufacturer1 ComponentHeight: 0.6mm; HelpURL: \\cern.ch\dfs\Applications\Altium\Datasheets\R2512_VISHAY_CRCW0805.pdf; Author: CERN DEM JLC; CreateDate: 18.04.2013; LatestRevisionDate: 18.04.2013
R433 = R0402_NO-VALUE: Resistor; Part Description: Reserved Footprint For a 0402 (1005) Chip Resistor; PressFit: No; Mounted: No; Manufacturer Part Number: R0402_NO-VALUE; Manufacturer: Undefined; Part Number: R0402_NO-VALUE; Value: Undefined; Component Kind: Standard; Component Type: Standard; Pin Count: 2; Status: None; Case: 0402; Sense: No; Socket: No; SMD: Yes; Manufacturer1 Example: Undefined; Manufacturer1 Part Number: Undefined; Manufacturer1 ComponentHeight: Undefined; HelpURL: Undefined; Author: CERN DEM JLC; CreateDate: 03.12.2007; LatestRevisionDate: 13.03.2008
R434 R435 = R0402_10K_1%_0.0625W_100PPM: as R103 on sheet DAC_supply; Manufacturer Part Number: R0402_10K_1%_0.0625W_100PPM; Part Number: R0402_10K_1%_0.0625W_100PPM; Tolerance: ±1%; Value: 10k; Component Kind: Standard; Component Type: Standard; Pin Count: 2; Status: Not Recommended; Power: 0.0625W; Case: 0402; Mounted: Yes; Sense: No; Socket: No; SMD: Yes; Manufacturer1 Example: YAGEO PHYCOMP; Manufacturer1 ComponentHeight: 0.4mm; HelpURL: \\cern.ch\dfs\Applications\Altium\Datasheets\R0402_Phycomp_RC0402.pdf; Author: CERN DEM JLC; CreateDate: 03.12.2007; LatestRevisionDate: 17.10.2012
R436 = R0402_10K_1%_0.0625W_100PPM: Resistor - 1%; Part Description: General Purpose Thick Film Chip Resistor; Manufacturer: GENERIC; Manufacturer1 Part Number: 232270671003L; TC: ±100ppm/°C; PressFit: No; Part Number: R0402_10K_1%_0.0625W_100PPM; Component Kind: Standard; Component Type: Standard; Pin Count: 2; Value: 10k; Status: Not Recommended; Power: 0.0625W; Tolerance: ±1%; Manufacturer Part Number: R0402_10K_1%_0.0625W_100PPM; Case: 0402; Mounted: Yes; Sense: No; Socket: No; SMD: Yes; Manufacturer1 Example: YAGEO PHYCOMP; Manufacturer1 ComponentHeight: 0.4mm; HelpURL: \\cern.ch\dfs\Applications\Altium\Datasheets\R0402_Phycomp_RC0402.pdf; Author: CERN DEM JLC; CreateDate: 03.12.2007; LatestRevisionDate: 17.10.2012
R437 R438 = R0402_100K_1%_0.0625W_100PPM: Resistor - 1%; Manufacturer: GENERIC; Part Description: General Purpose Thick Film Chip Resistor; Manufacturer1 Part Number: 232270671004L; TC: ±100ppm/°C; PressFit: No; Manufacturer Part Number: R0402_100K_1%_0.0625W_100PPM; Part Number: R0402_100K_1%_0.0625W_100PPM; Tolerance: ±1%; Value: 100k; Component Kind: Standard; Component Type: Standard; Pin Count: 2; Status: Not Recommended; Power: 0.0625W; Case: 0402; Mounted: Yes; Sense: No; Socket: No; SMD: Yes; Manufacturer1 Example: YAGEO PHYCOMP; Manufacturer1 ComponentHeight: 0.4mm; HelpURL: \\cern.ch\dfs\Applications\Altium\Datasheets\R0402_Phycomp_RC0402.pdf; Author: CERN DEM JLC; CreateDate: 03.12.2007; LatestRevisionDate: 17.10.2012
R461 = R0402_2K_1%_0.0625W_100PPM: Resistor - 1%; Part Description: General Purpose Thick Film Chip Resistor; Manufacturer: GENERIC; Manufacturer1 Part Number: 232270672002L; TC: ±100ppm/°C; PressFit: No; Part Number: R0402_2K_1%_0.0625W_100PPM; Component Kind: Standard; Component Type: Standard; Pin Count: 2; Value: 2k; Status: Not Recommended; Power: 0.0625W; Tolerance: ±1%; Manufacturer Part Number: R0402_2K_1%_0.0625W_100PPM; Case: 0402; Mounted: Yes; Sense: No; Socket: No; SMD: Yes; Manufacturer1 Example: YAGEO PHYCOMP; Manufacturer1 ComponentHeight: 0.4mm; HelpURL: \\cern.ch\dfs\Applications\Altium\Datasheets\R0402_Phycomp_RC0402.pdf; Author: CERN DEM JLC; CreateDate: 03.12.2007; LatestRevisionDate: 17.10.2012
TP32 = SMD_PAD_1.27X1.27MM: Part Description: 1.27mm x 1.27mm PCB Copper Area (SMD Test Point); Mounted: No; Part Number: SMD_PAD_1.27X1.27MM; Component Kind: Standard (No BOM); Component Type: Standard (No BOM); Pin Count: 1; Family: Test Point; Socket: No; SMD: Yes; Sense: No; Status: None; ComponentHeight: 0mm; HelpURL: Undefined; Author: CERN DEM JLC; CreateDate: 12.01.2008; LatestRevisionDate: 12.01.2008; PackageDescription: 1.27mm x 1.27mm PCB Copper Area (SMD Test Point)